# EAGLE schematic doorduino3 (EAGLE 7.4.0)

## Sheet 1 of 2
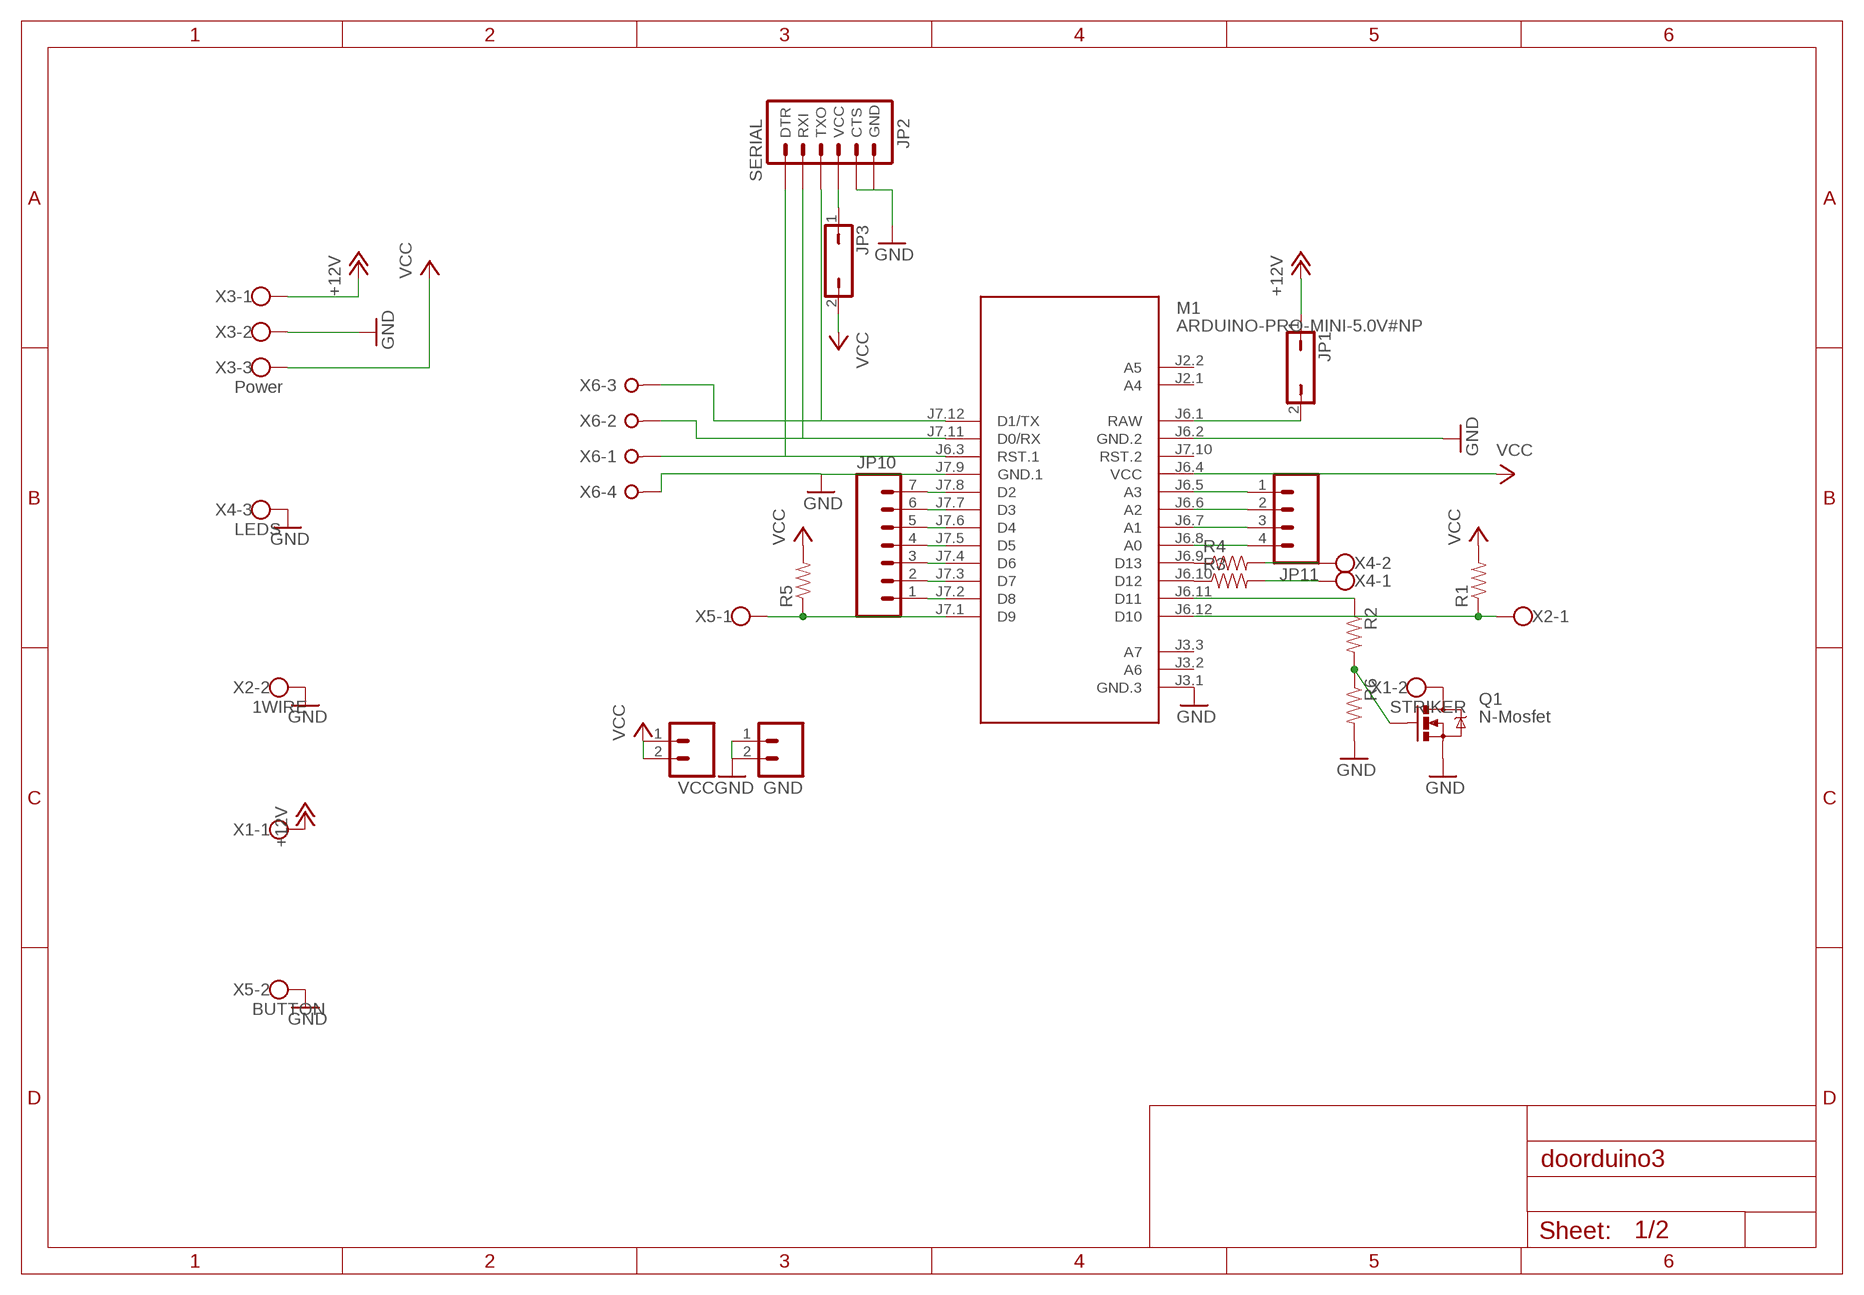
[diagram p0: schematic, sheet 1]

### Parts
GND  M021X02_NO_SILK  [1X02_NO_SILK]
JP1  JP1Q  [JP1]
JP2  SERIAL  ARDUINO_SERIAL_PROGRAMLONGPADS  [1X06_LONGPADS]
JP3  JP1Q  [JP1]
JP10  M07  [1X07]
JP11  M04NO_SILK_ALL_ROUND  [1X04_NO_SILK_ALL_ROUND]
M1  ARDUINO-PRO-MINI-5.0V#NP  [ARDUINO-PRO-MINI#NP]
Q1  N-Mosfet  MOSFET-NCHANNELFQP30N06L  [TO220V]
R1  RESISTOR0805-RES  [0805]
R2  RESISTOR0805-RES  [0805]
R3  RESISTOR0805-RES  [0805]
R4  RESISTOR0805-RES  [0805]
R5  RESISTOR0805-RES  [0805]
R6  RESISTOR0805-RES  [0805]
VCC  M021X02_NO_SILK  [1X02_NO_SILK]
X1  STRIKER  W237-102  [W237-102]
X2  1WIRE  W237-102  [W237-102]
X3  Power  W237-103  [W237-103]
X4  LEDS  W237-103  [W237-103]
X5  BUTTON  W237-102  [W237-102]
X6  W237-04P  [W237-4P]

### Nets
+12V: JP1.1 X1.1 X3.1
GND: GND.1 GND.2 JP2.5(CTS) JP2.6(GND) M1.J3.1(GND.3) M1.J6.2(GND.2) M1.J7.9(GND.1) Q1.3(S) R6.2 X2.2 X3.2 X4.3 X5.2 X6.4
N$1: JP1.2 M1.J6.1(RAW)
N$2: M1.J6.12(D10) R1.1 X2.1
N$3: M1.J6.11(D11) R2.1
N$4: Q1.1(G) R2.2 R6.1
N$5: Q1.2(D) X1.2
N$6: M1.J6.10(D12) R3.1
N$7: M1.J6.9(D13) R4.1
N$8: R3.2 X4.1
N$9: R4.2 X4.2
N$10: M1.J7.1(D9) R5.1 X5.1
N$11: JP2.3(TXO) M1.J7.12(D1/TX) X6.3
N$12: JP2.2(RXI) M1.J7.11(D0/RX) X6.2
N$13: JP2.4(VCC) JP3.1
N$14: JP2.1(DTR) M1.J6.3(RST.1) X6.1
N$15: JP10.1 M1.J7.2(D8)
N$16: JP10.2 M1.J7.3(D7)
N$17: JP10.3 M1.J7.4(D6)
N$18: JP10.4 M1.J7.5(D5)
N$19: JP10.5 M1.J7.6(D4)
N$20: JP10.6 M1.J7.7(D3)
N$21: JP10.7 M1.J7.8(D2)
N$22: JP11.1 M1.J6.5(A3)
N$23: JP11.2 M1.J6.6(A2)
N$24: JP11.3 M1.J6.7(A1)
N$25: JP11.4 M1.J6.8(A0)
VCC: JP3.2 M1.J6.4(VCC) R1.2 R5.2 VCC.1 VCC.2 X3.3
Unconnected: M1.J2.1(A4) M1.J2.2(A5) M1.J3.2(A6) M1.J3.3(A7) M1.J7.10(RST.2)

## Sheet 2 of 2
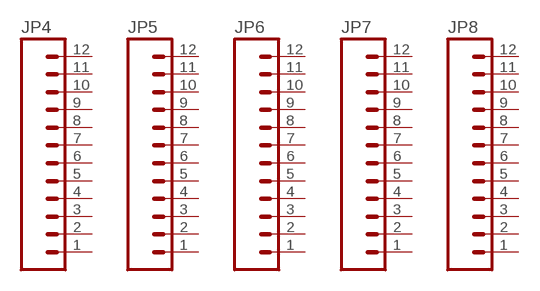
[diagram p1: schematic, sheet 2]

### Parts
JP4  M12NO_SILK  [1X12_NO_SILK]
JP5  M12NO_SILK  [1X12_NO_SILK]
JP6  M12NO_SILK  [1X12_NO_SILK]
JP7  M12NO_SILK  [1X12_NO_SILK]
JP8  M12NO_SILK  [1X12_NO_SILK]
Unconnected: JP4.1 JP4.2 JP4.3 JP4.4 JP4.5 JP4.6 JP4.7 JP4.8 JP4.9 JP4.10 JP4.11 JP4.12 JP5.1 JP5.2 JP5.3 JP5.4 JP5.5 JP5.6 JP5.7 JP5.8 JP5.9 JP5.10 JP5.11 JP5.12 JP6.1 JP6.2 JP6.3 JP6.4 JP6.5 JP6.6 JP6.7 JP6.8 JP6.9 JP6.10 JP6.11 JP6.12 JP7.1 JP7.2 JP7.3 JP7.4 JP7.5 JP7.6 JP7.7 JP7.8 JP7.9 JP7.10 JP7.11 JP7.12 JP8.1 JP8.2 JP8.3 JP8.4 JP8.5 JP8.6 JP8.7 JP8.8 JP8.9 JP8.10 JP8.11 JP8.12

## Library data of the parts
GND VCC = SparkFun-Connectors:M02: Standard 2-pin 0.1" header. Use with - straight break away headers ( PRT-00116) - right angle break away headers (PRT-00553) - swiss pins (PRT-00743) - machine pins (PRT-00117) - female headers (PRT-00115) Molex polarized connector foot print use with: PRT-08233 with associated crimp pins and housings. 2.54_SCREWTERM for use with PRT-10571. 3.5mm Screw Terminal footprints for PRT-08084 5mm Screw Terminal footprints for use with PRT-08432
JP1 JP3 = jumper:JP1Q: JUMPER
JP2 = SparkFun-Connectors:ARDUINO_SERIAL_PROGRAM: FTDI connector footprints
JP4-JP8 = SparkFun-Connectors:M12: Header 12 Standard 12-pin 0.1" header. Use with straight break away headers (SKU : PRT-00116), right angle break away headers (PRT-00553), swiss pins (PRT-00743), machine pins (PRT-00117), and female headers (PRT-00115).
JP10 = SparkFun-Connectors:M07: Header 7 Standard 7-pin 0.1" header. Use with straight break away headers (SKU : PRT-00116), right angle break away headers (PRT-00553), swiss pins (PRT-00743), machine pins (PRT-00117), and female headers (PRT-00115). NOTES ON THE VARIANTS LOCK and LOCK_LONGPADS... This footprint was designed to help hold the alignment of a through-hole component (i.e. 7-pin header) while soldering it into place. You may notice that each hole has been shifted either up or down by 0.005 of an inch from it's more standard position (which is usually a perfectly straight line). This slight alteration caused the pins (the squares in the middle) to touch the edges of the holes. Because they are alternating, it causes a "brace" to hold the header in place. 0.005 has proven to be the perfect amount of "off-center" position when using our standard breakaway headers. Although looks a little odd when you look at the bare footprint, once you have a header in there, the alteration is very hard to notice. Also, if you push a header all the way into place, it is covered up entirely on the bottom side. This idea of altering the position of holes to aid alignment will be further integrated into the Sparkfun Library for other footprints. It can help hold any component with 3 or more connection pins.
JP11 = SparkFun-Connectors:M04: Header 4 Standard 4-pin 0.1" header. Use with straight break away headers (SKU : PRT-00116), right angle break away headers (PRT-00553), swiss pins (PRT-00743), machine pins (PRT-00117), and female headers (PRT-00115). Molex polarized connector foot print use with SKU : PRT-08231 with associated crimp pins and housings. 1MM SMD Version SKU: PRT-10208
M1 = diy-modules:ARDUINO-PRO-MINI-*#NP: Arduino Pro Mini without programming pads
Q1 = SparkFun-DiscreteSemi:MOSFET-NCHANNEL: Common NMOSFET Parts MFG P/N Store ID Prod ID FDD8780 TRANS-09984 SI7820DN TRANS-11055 FDS6630A IC-08089 2N7002PW TRANS-11151 FQP30N06L COM-10213 TRANS-10060 BSS123LT1G TRANS-08345 BSS138 TRANS-00830 BS170 2N7000; PROD_ID: TRANS-10060
R1-R6 = SparkFun-Passives:RESISTOR: Resistor Basic schematic elements and footprints for 0603, 1206, and PTH resistors.
X1 X2 X5 = con-wago-500:W237-102: WAGO SCREW CLAMP; MPN: 237-102; OC_FARNELL: unknown; OC_NEWARK: 70K9898
X3 X4 = con-wago-500:W237-103: WAGO SCREW CLAMP; MPN: 237-103; OC_FARNELL: unknown; OC_NEWARK: 18M7116
X6 = con-wago-508:W237-04P: WAGO SREW CLAMP; OC_FARNELL: unknown; OC_NEWARK: unknown